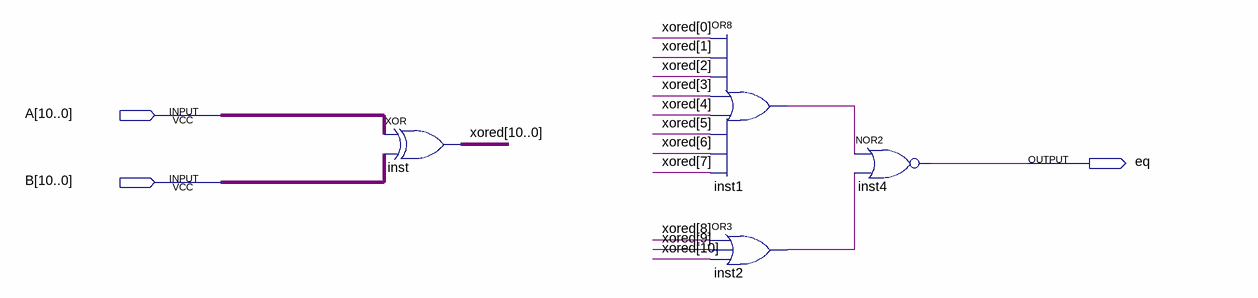
[diagram p0: schematic sheet]
// Quartus schematic cmp11_eq.bdf as structural Verilog: 4 symbols, 3 pins
module cmp11_eq (
  input  [10:0] A,
  input  [10:0] B,
  output eq
);

  wire inst1_out, inst2_out;
  wire [10:0] xored;

  assign xored = A ^ B;  // XOR inst, 11 bits wide
  or inst1 (inst1_out, xored[0], xored[1], xored[2], xored[3], xored[4], xored[5], xored[6], xored[7]);
  or inst2 (inst2_out, xored[8], xored[9], xored[10]);
  nor inst4 (eq, inst1_out, inst2_out);
endmodule
